# Altium schematic sheet FPGAPort.SchDoc
size A
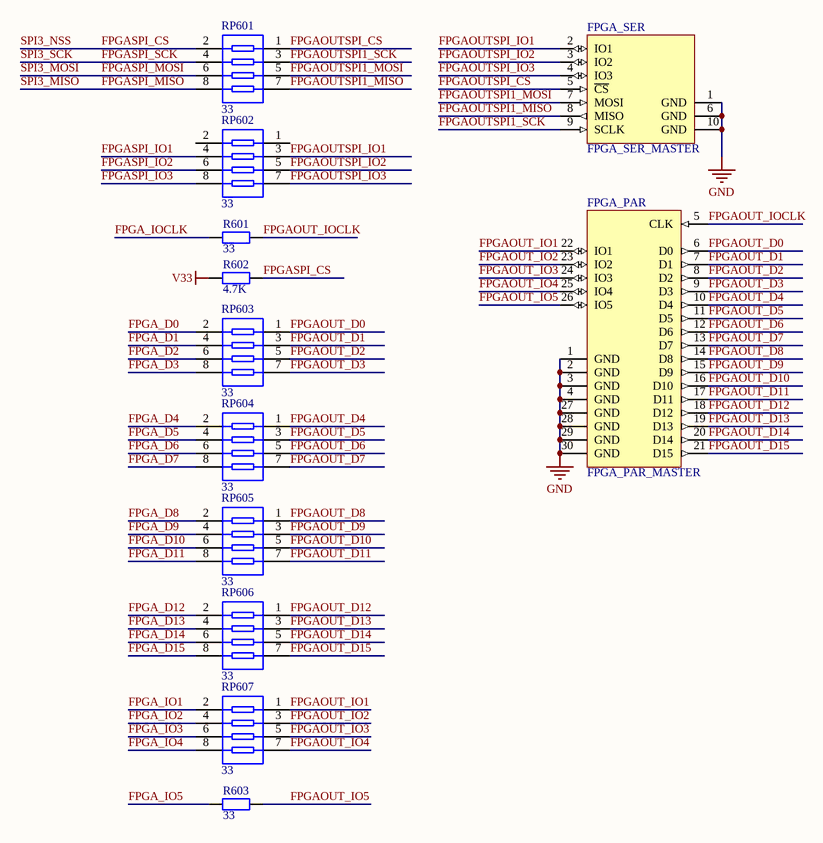
[diagram p0: FPGAPort.SchDoc]

## Parts
FPGA_PAR  FPGA_PAR_MASTER  [IDC30]
FPGA_SER  FPGA_SER_MASTER  [IDC10]
R601  value 33  [0603R]  (hidden comment: Resistor)
R602  value 4.7K  [0603R]  (hidden comment: Resistor)
R603  value 33  [0603R]  (hidden comment: Resistor)
RP601  value 33  [8P4R_0603]  (hidden comment: Res Pack)
RP602  value 33  [8P4R_0603]  (hidden comment: Res Pack)
RP603  value 33  [8P4R_0603]  (hidden comment: Res Pack)
RP604  value 33  [8P4R_0603]  (hidden comment: Res Pack)
RP605  value 33  [8P4R_0603]  (hidden comment: Res Pack)
RP606  value 33  [8P4R_0603]  (hidden comment: Res Pack)
RP607  value 33  [8P4R_0603]  (hidden comment: Res Pack)

## Nets
GND: FPGA_PAR.1(GND) FPGA_PAR.2(GND) FPGA_PAR.3(GND) FPGA_PAR.4(GND) FPGA_PAR.27(GND) FPGA_PAR.28(GND) FPGA_PAR.29(GND) FPGA_PAR.30(GND) FPGA_SER.1(GND) FPGA_SER.6(GND) FPGA_SER.10(GND)
V33: R602.1
FPGA_D0: RP603.2
FPGA_D1: RP603.4
FPGA_D2: RP603.6
FPGA_D3: RP603.8
FPGA_D4: RP604.2
FPGA_D5: RP604.4
FPGA_D6: RP604.6
FPGA_D7: RP604.8
FPGA_D8: RP605.2
FPGA_D9: RP605.4
FPGA_D10: RP605.6
FPGA_D11: RP605.8
FPGA_D12: RP606.2
FPGA_D13: RP606.4
FPGA_D14: RP606.6
FPGA_D15: RP606.8
FPGA_IO1: RP607.2
FPGA_IO2: RP607.4
FPGA_IO3: RP607.6
FPGA_IO4: RP607.8
FPGA_IO5: R603.1
FPGA_IOCLK: R601.1
FPGAOUT_D0: FPGA_PAR.6(D0) RP603.1
FPGAOUT_D1: FPGA_PAR.7(D1) RP603.3
FPGAOUT_D2: FPGA_PAR.8(D2) RP603.5
FPGAOUT_D3: FPGA_PAR.9(D3) RP603.7
FPGAOUT_D4: FPGA_PAR.10(D4) RP604.1
FPGAOUT_D5: FPGA_PAR.11(D5) RP604.3
FPGAOUT_D6: FPGA_PAR.12(D6) RP604.5
FPGAOUT_D7: FPGA_PAR.13(D7) RP604.7
FPGAOUT_D8: FPGA_PAR.14(D8) RP605.1
FPGAOUT_D9: FPGA_PAR.15(D9) RP605.3
FPGAOUT_D10: FPGA_PAR.16(D10) RP605.5
FPGAOUT_D11: FPGA_PAR.17(D11) RP605.7
FPGAOUT_D12: FPGA_PAR.18(D12) RP606.1
FPGAOUT_D13: FPGA_PAR.19(D13) RP606.3
FPGAOUT_D14: FPGA_PAR.20(D14) RP606.5
FPGAOUT_D15: FPGA_PAR.21(D15) RP606.7
FPGAOUT_IO1: FPGA_PAR.22(IO1) RP607.1
FPGAOUT_IO2: FPGA_PAR.23(IO2) RP607.3
FPGAOUT_IO3: FPGA_PAR.24(IO3) RP607.5
FPGAOUT_IO4: FPGA_PAR.25(IO4) RP607.7
FPGAOUT_IO5: FPGA_PAR.26(IO5) R603.2
FPGAOUT_IOCLK: FPGA_PAR.5(CLK) R601.2
FPGAOUTSPI1_MISO: FPGA_SER.8(MISO) RP601.7
FPGAOUTSPI1_MOSI: FPGA_SER.7(MOSI) RP601.5
FPGAOUTSPI1_SCK: FPGA_SER.9(SCLK) RP601.3
FPGAOUTSPI_CS: FPGA_SER.5(~{CS}) RP601.1
FPGAOUTSPI_IO1: FPGA_SER.2(IO1) RP602.3
FPGAOUTSPI_IO2: FPGA_SER.3(IO2) RP602.5
FPGAOUTSPI_IO3: FPGA_SER.4(IO3) RP602.7
FPGASPI_CS: R602.2 RP601.2  [also labelled SPI3_NSS]
FPGASPI_IO1: RP602.4
FPGASPI_IO2: RP602.6
FPGASPI_IO3: RP602.8
FPGASPI_MISO: RP601.8  [also labelled SPI3_MISO]
FPGASPI_MOSI: RP601.6  [also labelled SPI3_MOSI]
FPGASPI_SCK: RP601.4  [also labelled SPI3_SCK]

Not connected (* = marked no-connect by the designer): RP602 1 2

## Library data of the parts
FPGA_PAR = FPGA_PAR_MASTER: FPGA parallel port
FPGA_SER = FPGA_SER_MASTER: FPGA serial port
RP601-RP607 = Res Pack: Isolated Resistor Network